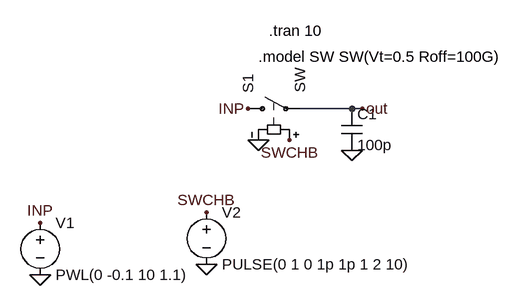
[diagram p0: schematic tb_SW.asc]
tb_SW.asc, the LTspice schematic file:
Version 4
SHEET 1 1368 988
WIRE 304 128 224 128
WIRE 320 128 304 128
FLAG 144 128 INP
FLAG 160 176 0
FLAG 208 176 SWCHB
FLAG -176 304 INP
FLAG -176 384 0
FLAG 80 368 0
FLAG 80 288 SWCHB
FLAG 320 128 out
FLAG 304 192 0
SYMBOL sw 128 128 R270
SYMATTR InstName S1
SYMBOL voltage -176 288 R0
SYMATTR InstName V1
SYMATTR Value PWL(0 -0.1 10 1.1)
SYMBOL voltage 80 272 R0
WINDOW 123 0 0 Left 0
WINDOW 39 0 0 Left 0
SYMATTR InstName V2
SYMATTR Value PULSE(0 1 0 1p 1p 1 2 10)
SYMBOL cap 288 128 R0
SYMATTR InstName C1
SYMATTR Value 100p
TEXT 160 48 Left 2 !.model SW SW(Vt=0.5 Roff=100G)
TEXT 176 8 Left 2 !.tran 10

The netlist it stands for:
* tb_SW.asc
S1 INP out SWCHB 0 SW
V1 INP 0 PWL(0 -0.1 10 1.1)
V2 SWCHB 0 PULSE(0 1 0 1p 1p 1 2 10)
C1 out 0 100p
.model SW SW(Vt=0.5 Roff=100G)
.tran 10
.backanno
.end